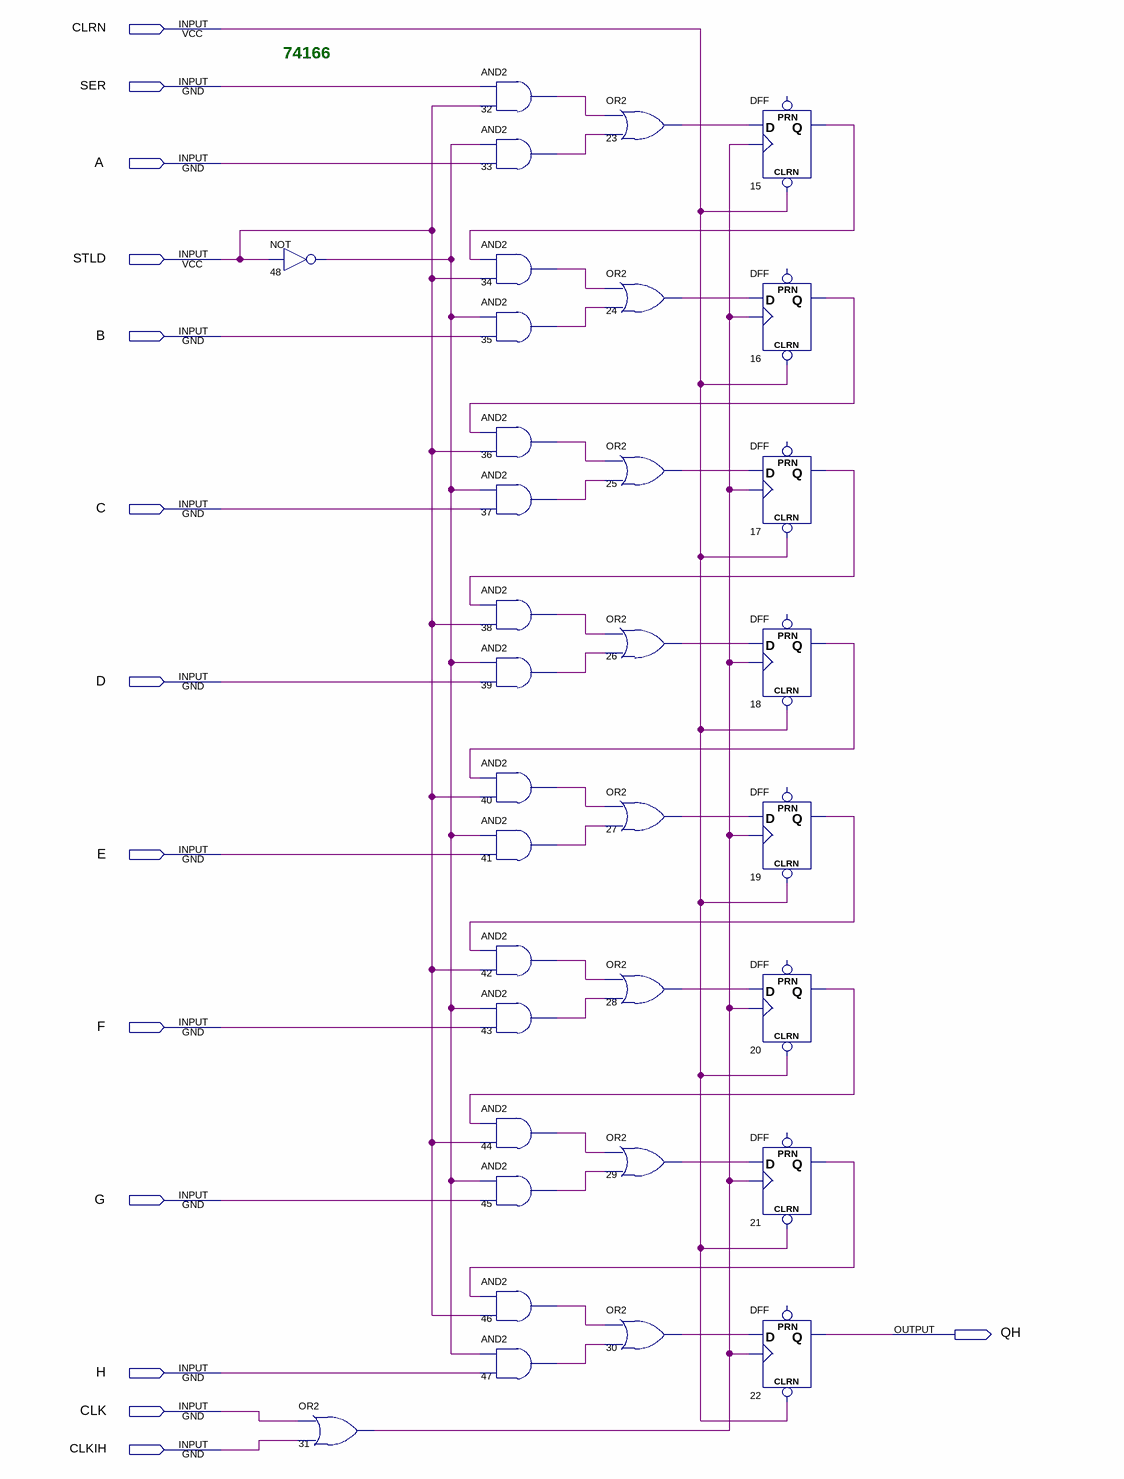
[diagram p0: schematic sheet]
// Quartus schematic 74166.bdf as structural Verilog: 34 symbols, 14 pins
module \74166  (
  input  CLRN,
  input  SER,
  input  A,
  input  STLD,
  input  B,
  input  C,
  input  D,
  input  E,
  input  F,
  input  G,
  input  H,
  input  CLK,
  input  CLKIH,
  output QH
);

  wire n15_q, n16_q, n17_q, n18_q, n19_q, n20_q, n21_q, n23_out, n24_out, n25_out, n26_out, n27_out, n28_out,
       n29_out, n30_out, n31_out, n32_out, n33_out, n34_out, n35_out, n36_out, n37_out, n38_out, n39_out,
       n40_out, n41_out, n42_out, n43_out, n44_out, n45_out, n46_out, n47_out, n48_out;

  not u_48 (n48_out, STLD);
  or u_31 (n31_out, CLK, CLKIH);
  and u_32 (n32_out, SER, STLD);
  and u_33 (n33_out, n48_out, A);
  and u_34 (n34_out, n15_q, STLD);
  and u_35 (n35_out, n48_out, B);
  and u_36 (n36_out, n16_q, STLD);
  and u_37 (n37_out, n48_out, C);
  and u_38 (n38_out, n17_q, STLD);
  and u_39 (n39_out, n48_out, D);
  and u_40 (n40_out, n18_q, STLD);
  and u_41 (n41_out, n48_out, E);
  and u_42 (n42_out, n19_q, STLD);
  and u_43 (n43_out, n48_out, F);
  and u_44 (n44_out, n20_q, STLD);
  and u_45 (n45_out, n48_out, G);
  and u_46 (n46_out, n21_q, STLD);
  and u_47 (n47_out, n48_out, H);
  or u_23 (n23_out, n32_out, n33_out);
  or u_24 (n24_out, n34_out, n35_out);
  or u_25 (n25_out, n36_out, n37_out);
  or u_26 (n26_out, n38_out, n39_out);
  or u_27 (n27_out, n40_out, n41_out);
  or u_28 (n28_out, n42_out, n43_out);
  or u_29 (n29_out, n44_out, n45_out);
  or u_30 (n30_out, n46_out, n47_out);
  DFF u_15 (.CLRN(CLRN), .CLK(n31_out), .D(n23_out), .Q(n15_q));  // open: PRN
  DFF u_16 (.CLRN(CLRN), .CLK(n31_out), .D(n24_out), .Q(n16_q));  // open: PRN
  DFF u_17 (.CLRN(CLRN), .CLK(n31_out), .D(n25_out), .Q(n17_q));  // open: PRN
  DFF u_18 (.CLRN(CLRN), .CLK(n31_out), .D(n26_out), .Q(n18_q));  // open: PRN
  DFF u_19 (.CLRN(CLRN), .CLK(n31_out), .D(n27_out), .Q(n19_q));  // open: PRN
  DFF u_20 (.CLRN(CLRN), .CLK(n31_out), .D(n28_out), .Q(n20_q));  // open: PRN
  DFF u_21 (.CLRN(CLRN), .CLK(n31_out), .D(n29_out), .Q(n21_q));  // open: PRN
  DFF u_22 (.CLRN(CLRN), .CLK(n31_out), .D(n30_out), .Q(QH));  // open: PRN

  // Notes on the sheet:
  //   74166
endmodule
